# Altium schematic sheet NANO103.SchDoc
size A3
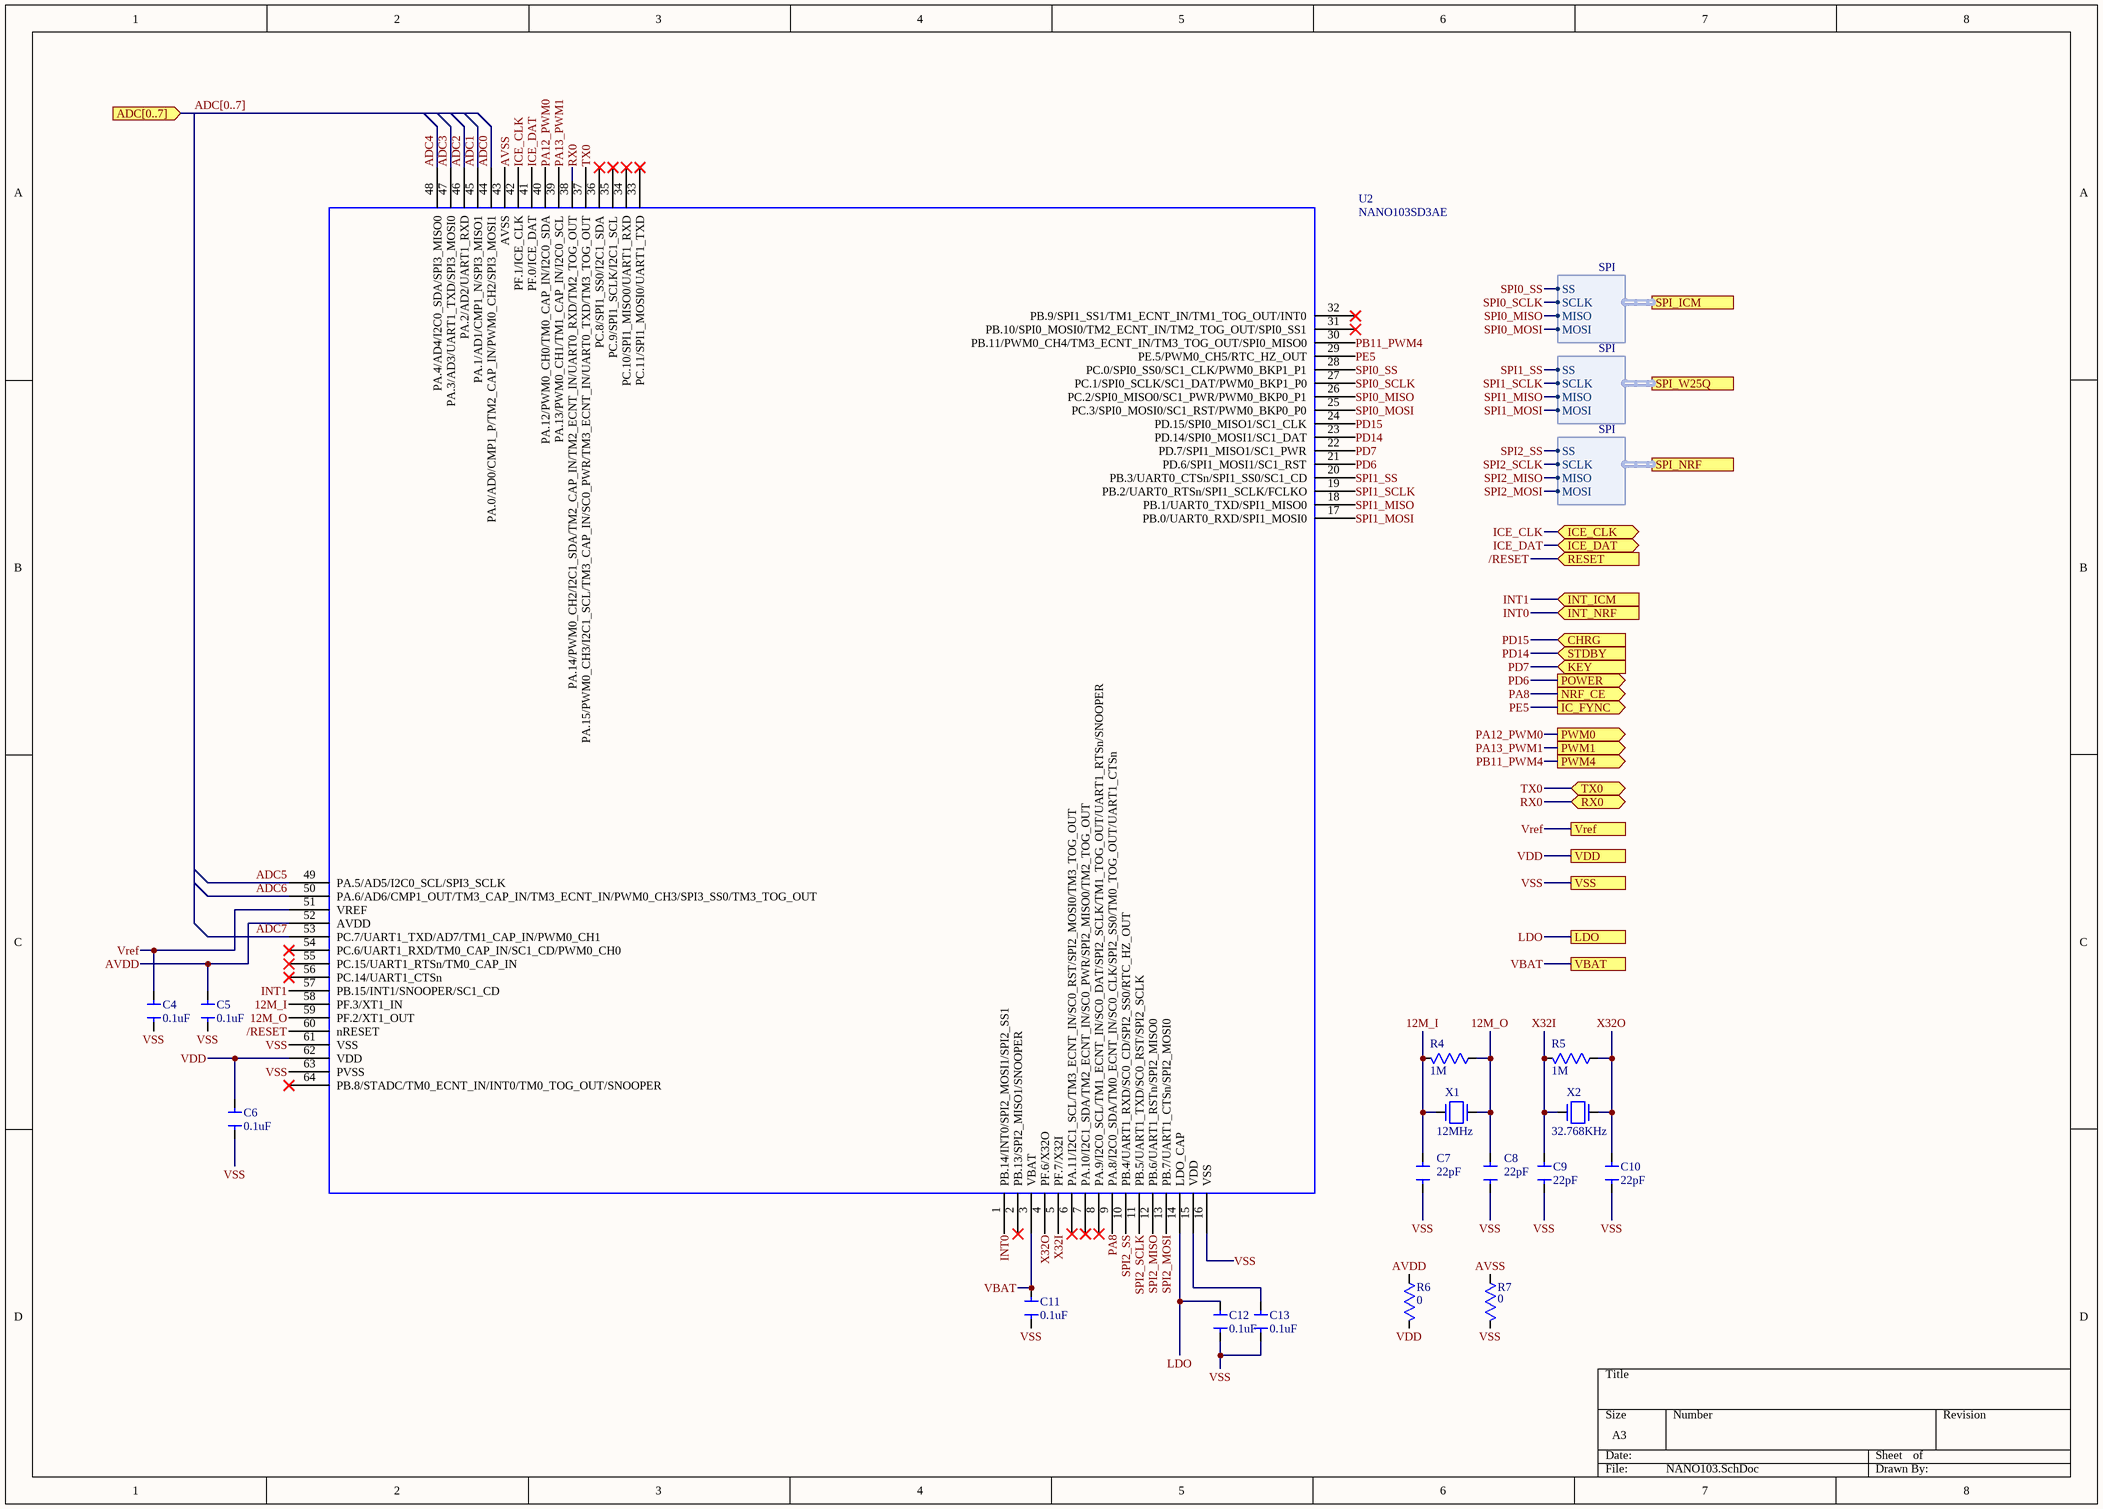
[diagram p0: NANO103.SchDoc]

## Parts
C4  value 0.1uF  [CAP_0402]  (hidden comment: Cap)
C5  value 0.1uF  [CAP_0402]  (hidden comment: Cap)
C6  value 0.1uF  [CAP_0402]  (hidden comment: Cap)
C7  value 22pF  [CAP_0402]  (hidden comment: Cap)
C8  value 22pF  [CAP_0402]  (hidden comment: Cap)
C9  value 22pF  [CAP_0402]  (hidden comment: Cap)
C10  value 22pF  [CAP_0402]  (hidden comment: Cap)
C11  value 0.1uF  [CAP_0402]  (hidden comment: Cap)
C12  value 0.1uF  [CAP_0402]  (hidden comment: Cap)
C13  value 0.1uF  [CAP_0402]  (hidden comment: Cap)
R4  value 1M  [RES_0402]  (hidden comment: Res)
R5  value 1M  [RES_0402]  (hidden comment: Res)
R6  value 0  [RES_0402]  (hidden comment: Res)
R7  value 0  [RES_0402]  (hidden comment: Res)
U2  NANO103SD3AE  [MCU_LQFP_64_7x7]
X1  value 12MHz  [2520S]  (hidden comment: Xtal)
X2  value 32.768KHz  [FC-135]  (hidden comment: Xtal)

## Ports
ADC[0..7] (in), CHRG (in), IC_FYNC (out), ICE_CLK (bidir), ICE_DAT (bidir), INT_ICM (in), INT_NRF (in), KEY (in), LDO, NRF_CE (out), POWER (out), PWM0 (out), PWM1 (out), PWM4 (out), RESET (in), RX0 (bidir), SPI_ICM (harness SPI), SPI_NRF (harness SPI), SPI_W25Q (harness SPI), STDBY (in), TX0 (bidir), VBAT, VDD, Vref, VSS

## Harnesses
SPI: SS, MISO, MOSI, SCLK

## Nets
12M_I: C7.1 R4.1 U2.58(PF.3/XT1_IN) X1.2
12M_O: C8.1 R4.2 U2.59(PF.2/XT1_OUT) X1.1
/RESET: U2.60(nRESET) ; port RESET
ADC0: U2.44(PA.0/AD0/CMP1_P/TM2_CAP_IN/PWM0_CH2/SPI3_MOSI1)
ADC1: U2.45(PA.1/AD1/CMP1_N/SPI3_MISO1)
ADC2: U2.46(PA.2/AD2/UART1_RXD)
ADC3: U2.47(PA.3/AD3/UART1_TXD/SPI3_MOSI0)
ADC4: U2.48(PA.4/AD4/I2C0_SDA/SPI3_MISO0)
ADC5: U2.49(PA.5/AD5/I2C0_SCL/SPI3_SCLK)
ADC6: U2.50(PA.6/AD6/CMP1_OUT/TM3_CAP_IN/TM3_ECNT_IN/PWM0_CH3/SPI3_SS0/TM3_TOG_OUT)
ADC7: U2.53(PC.7/UART1_TXD/AD7/TM1_CAP_IN/PWM0_CH1)
AVDD: C5.2 R6.2 U2.52(AVDD)
AVSS: R7.2 U2.43(AVSS)
ICE_CLK: U2.42(PF.1/ICE_CLK) ; port ICE_CLK
ICE_DAT: U2.41(PF.0/ICE_DAT) ; port ICE_DAT
INT0: U2.1(PB.14/INT0/SPI2_MOSI1/SPI2_SS1) ; port INT_NRF
INT1: U2.57(PB.15/INT1/SNOOPER/SC1_CD) ; port INT_ICM
LDO: C12.2 U2.14(LDO_CAP) ; port LDO
PA8: U2.9(PA.8/I2C0_SDA/TM0_ECNT_IN/SC0_CLK/SPI2_SS0/TM0_TOG_OUT/UART1_CTSn) ; port NRF_CE
PA12_PWM0: U2.40(PA.12/PWM0_CH0/TM0_CAP_IN/I2C0_SDA) ; port PWM0
PA13_PWM1: U2.39(PA.13/PWM0_CH1/TM1_CAP_IN/I2C0_SCL) ; port PWM1
PB11_PWM4: U2.30(PB.11/PWM0_CH4/TM3_ECNT_IN/TM3_TOG_OUT/SPI0_MISO0) ; port PWM4
PD6: U2.21(PD.6/SPI1_MOSI1/SC1_RST) ; port POWER
PD7: U2.22(PD.7/SPI1_MISO1/SC1_PWR) ; port KEY
PD14: U2.23(PD.14/SPI0_MOSI1/SC1_DAT) ; port STDBY
PD15: U2.24(PD.15/SPI0_MISO1/SC1_CLK) ; port CHRG
PE5: U2.29(PE.5/PWM0_CH5/RTC_HZ_OUT) ; port IC_FYNC
RX0: U2.38(PA.14/PWM0_CH2/I2C1_SDA/TM2_CAP_IN/TM2_ECNT_IN/UART0_RXD/TM2_TOG_OUT) ; port RX0
SPI0_MISO: U2.26(PC.2/SPI0_MISO0/SC1_PWR/PWM0_BKP0_P1) ; port SPI_ICM.MISO
SPI0_MOSI: U2.25(PC.3/SPI0_MOSI0/SC1_RST/PWM0_BKP0_P0) ; port SPI_ICM.MOSI
SPI0_SCLK: U2.27(PC.1/SPI0_SCLK/SC1_DAT/PWM0_BKP1_P0) ; port SPI_ICM.SCLK
SPI0_SS: U2.28(PC.0/SPI0_SS0/SC1_CLK/PWM0_BKP1_P1) ; port SPI_ICM.SS
SPI1_MISO: U2.18(PB.1/UART0_TXD/SPI1_MISO0) ; port SPI_W25Q.MISO
SPI1_MOSI: U2.17(PB.0/UART0_RXD/SPI1_MOSI0) ; port SPI_W25Q.MOSI
SPI1_SCLK: U2.19(PB.2/UART0_RTSn/SPI1_SCLK/FCLKO) ; port SPI_W25Q.SCLK
SPI1_SS: U2.20(PB.3/UART0_CTSn/SPI1_SS0/SC1_CD) ; port SPI_W25Q.SS
SPI2_MISO: U2.12(PB.6/UART1_RSTn/SPI2_MISO0) ; port SPI_NRF.MISO
SPI2_MOSI: U2.13(PB.7/UART1_CTSn/SPI2_MOSI0) ; port SPI_NRF.MOSI
SPI2_SCLK: U2.11(PB.5/UART1_TXD/SC0_RST/SPI2_SCLK) ; port SPI_NRF.SCLK
SPI2_SS: U2.10(PB.4/UART1_RXD/SC0_CD/SPI2_SS0/RTC_HZ_OUT) ; port SPI_NRF.SS
TX0: U2.37(PA.15/PWM0_CH3/I2C1_SCL/TM3_CAP_IN/SC0_PWR/TM3_ECNT_IN/UART0_TXD/TM3_TOG_OUT) ; port TX0
VBAT: C11.2 U2.3(VBAT) ; port VBAT
VDD: C6.2 R6.1 U2.62(VDD) ; port VDD
Vref: C4.2 U2.51(VREF) ; port Vref
VSS: C4.1 C5.1 C6.1 C7.2 C8.2 C9.2 C10.2 C11.1 C12.1 C13.1 R7.1 U2.16(VSS) U2.61(VSS) U2.63(PVSS) ; port VSS
X32I: C9.1 R5.1 U2.5(PF.7/X32I) X2.2
X32O: C10.1 R5.2 U2.4(PF.6/X32O) X2.1
NetC13_2: C13.2 U2.15(VDD)

Not connected (* = marked no-connect by the designer): U2 2(PB.13/SPI2_MISO1/SNOOPER)* 6(PA.11/I2C1_SCL/TM3_ECNT_IN/SC0_RST/SPI2_MOSI0/TM3_TOG_OUT)* 7(PA.10/I2C1_SDA/TM2_ECNT_IN/SC0_PWR/SPI2_MISO0/TM2_TOG_OUT)* 8(PA.9/I2C0_SCL/TM1_ECNT_IN/SC0_DAT/SPI2_SCLK/TM1_TOG_OUT/UART1_RTSn/SNOOPER)* 31(PB.10/SPI0_MOSI0/TM2_ECNT_IN/TM2_TOG_OUT/SPI0_SS1)* 32(PB.9/SPI1_SS1/TM1_ECNT_IN/TM1_TOG_OUT/INT0)* 33(PC.11/SPI1_MOSI0/UART1_TXD)* 34(PC.10/SPI1_MISO0/UART1_RXD)* 35(PC.9/SPI1_SCLK/I2C1_SCL)* 36(PC.8/SPI1_SS0/I2C1_SDA)* 54(PC.6/UART1_RXD/TM0_CAP_IN/SC1_CD/PWM0_CH0)* 55(PC.15/UART1_RTSn/TM0_CAP_IN)* 56(PC.14/UART1_CTSn)* 64(PB.8/STADC/TM0_ECNT_IN/INT0/TM0_TOG_OUT/SNOOPER)*

## Buses and harness runs
bus ADC[0..7] = port ADC[0..7]

## Library data of the parts
U2 = NANO103SD3AE: OriginalSymbolOrigin: (0,0)